# EAGLE design Switch Board (EAGLE 7.5.0)
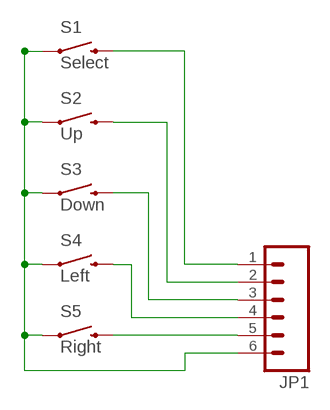
[diagram p0: schematic, sheet 1]

## Parts
JP1  M06SMD-1MM  [1X06-1MM]
S1  Select  SWITCH-MOMENTARY-2SMD  [TACTILE-SWITCH-SMD]
S2  Up  SWITCH-MOMENTARY-2SMD  [TACTILE-SWITCH-SMD]
S3  Down  SWITCH-MOMENTARY-2SMD  [TACTILE-SWITCH-SMD]
S4  Left  SWITCH-MOMENTARY-2SMD  [TACTILE-SWITCH-SMD]
S5  Right  SWITCH-MOMENTARY-2SMD  [TACTILE-SWITCH-SMD]

## Nets
GND: JP1.6 S1.1 S2.1 S3.1 S4.1 S5.1
N$1: JP1.5 S5.3
N$2: JP1.4 S4.3
N$3: JP1.3 S3.3
N$4: JP1.2 S2.3
N$5: JP1.1 S1.3

## Library data of the parts
JP1 = SparkFun-Connectors:M06: Header 6 Standard 6-pin 0.1" header. Use with straight break away headers (SKU : PRT-00116), right angle break away headers (PRT-00553), swiss pins (PRT-00743), machine pins (PRT-00117), and female headers (PRT-00115). Molex polarized connector foot print use with SKU : PRT-08094 with associated crimp pins and housings. NOTES ON THE VARIANTS LOCK and LOCK_LONGPADS... This footprint was designed to help hold the alignment of a through-hole component (i.e. 6-pin header) while soldering it into place. You may notice that each hole has been shifted either up or down by 0.005 of an inch from it's more standard position (which is a perfectly straight line). This slight alteration caused the pins (the squares in the middle) to touch the edges of the holes. Because they are alternating, it causes a "brace" to hold the component in place. 0.005 has proven to be the perfect amount of "off-center" position when using our standard breakaway headers. Although looks a little odd when you look at the bare footprint, once you have a header in there, the alteration is very hard to notice. Also,if you push a header all the way into place, it is covered up entirely on the bottom side. This idea of altering the position of holes to aid alignment will be further integrated into the Sparkfun Library for other footprints. It can help hold any component with 3 or more connection pins.
S1-S5 = SparkFun-Electromechanical:SWITCH-MOMENTARY-2: Various NO switches- pushbuttons, reed, etc; PROD_ID: SWCH-08247

## Board
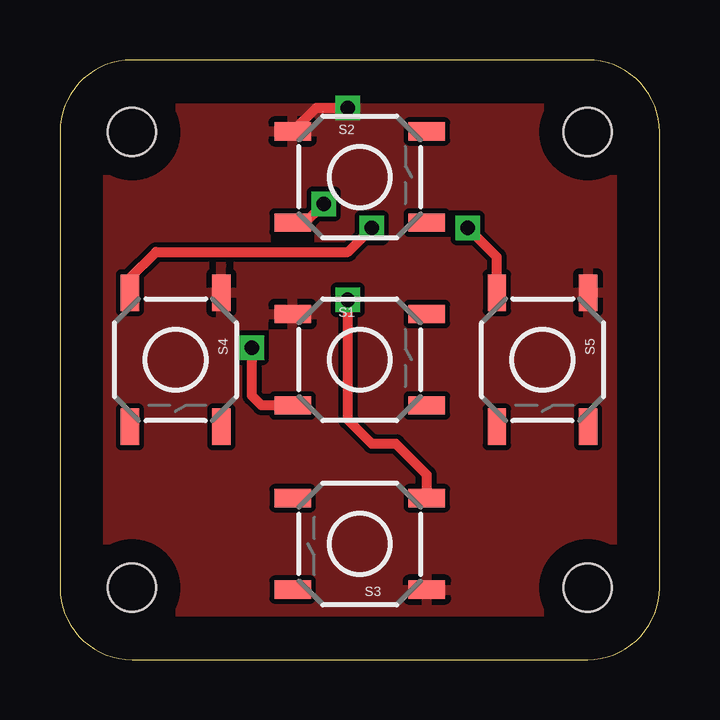
[diagram p1: board, top side]
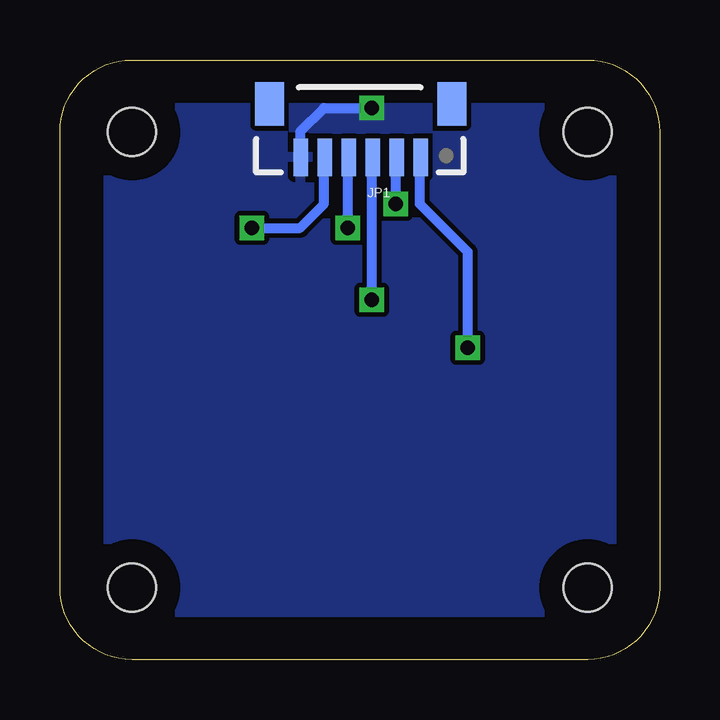
[diagram p2: board, bottom side, seen from below]

Size 25 x 25 mm. Coordinates in mm from the lower left corner, seen from the top.
Outline: 0,22 0,3 arc90 3,0 22,0 arc90 25,3 25,22 arc90 22,25 3,25 arc90 0,22
Copper layers (1*16): Top 0.035mm / dielectric 1.5mm / Bottom 0.035mm
Design rules "default": minimum track width 10mil, minimum drill 24mil, track to track 8mil, track to pad 8mil, pad to pad 8mil, via to via 8mil, smd to smd 8mil, copper to edge 40mil, drill to drill 8mil, minimum pad ring 10mil, minimum via ring 8mil, stop-mask expansion 4mil, vias tented up to drill 0mil, thermal gap 10mil
Holes 2 mm at 22,22 3,22 3,3 22,3

### Footprints (pad centres in the part's own frame; a part is rotated, then mirrored left to right if it is on the bottom)
1X06-1MM = smd 0.6 x 1.55: 1 -2.54,1.27; 2 -1.54,1.27; 3 -0.54,1.27; 4 0.46,1.27; 5 1.46,1.27; 6 2.46,1.27 | smd 1.2 x 1.8: P$1 -3.84,-0.955; P$2 3.76,-0.955
TACTILE-SWITCH-SMD = smd 1.524 x 0.762: 1 -2.794,1.905; 2 2.794,1.905; 3 -2.794,-1.905; 4 2.794,-1.905

### Placement (x,y rotation side)
JP1  12.5,22.21 180 bottom
S1  12.5,12.5 0 top
S2  12.5,20.12 0 top
S3  12.5,4.82 180 top
S4  4.82,12.5 270 top
S5  20.12,12.5 270 top

### Tracks (layer width: path | path; a pad name or v marks a point on that pad's centre or on a via)
GND  (via drill 0.6)
  Top 0.406: v12,23 10.68,23 S2.1
  Bottom 0.406: JP1.6 14.96,22.04 14,23 v12,23
  pour Bottom: 21,2 3,2 arc-90 2,3 2,22 arc-90 3,23 22,23 arc-90 23,22 23,3 arc-90
  pour Bottom: 21,2 3,2 arc-90 2,3 2,22 arc-90 3,23 22,23 arc-90 23,22 23,3 arc-90
  pour Top: 21,2 3,2 arc-90 2,3 2,22 arc-90 3,23 22,23 arc-90 23,22 23,3 arc-90
N$1  (via drill 0.6)
  Top 0.406: S5.3 18.21,16.79 v17,18
  Bottom 0.406: v17,18 15,18 14,19 14,20.9 JP1.5
N$2  (via drill 0.6)
  Top 0.406: S4.3 2.92,15.91 4,17 12,17 v13,18
  Bottom 0.406: v13,18 13,20.9 JP1.4
N$3  (via drill 0.6)
  Top 0.406: S3.3 15.29,7.71 14,9 13,9 12,10 v12,15
  Bottom 0.406: v12,15 12,20.9 JP1.3
N$4  (via drill 0.6)
  Top 0.406: S2.3 10.21,18.21 v11,19
  Bottom 0.406: v11,19 11,20.9 JP1.2
N$5  (via drill 0.6)
  Top 0.406: S1.3 8.4,10.6 8,11 v8,13
  Bottom 0.406: v8,13 8,17 10,19 10,20.9 JP1.1